# Altium schematic sheet PS.SchDoc
size A4
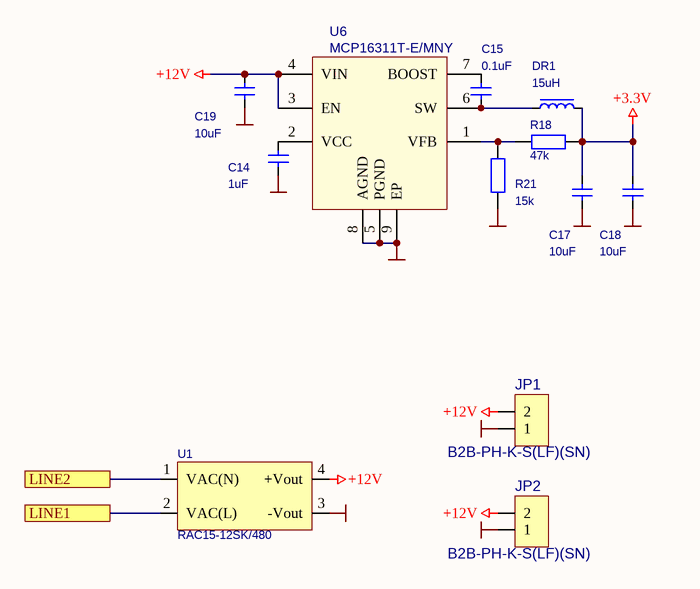
[diagram p0: PS.SchDoc]

## Parts
C14  1uF  [C-0805]
C15  0.1uF  [C-0603]
C17  10uF  [C-1206]
C18  10uF  [C-1206]
C19  10uF  [C-1206]
DR1  15uH  [NRS4018]
JP1  B2B-PH-K-S(LF)(SN)  [JST_B2B-PH-K-S]
JP2  B2B-PH-K-S(LF)(SN)  [JST_B2B-PH-K-S]
R18  47k  [R-0603]
R21  15k  [R-0603]
U1  RAC15-12SK/480  [RAC15]
U6  MCP16311T-E/MNY  [TDFN8]

## Ports
LINE1, LINE2

## Nets
+3.3V: C17.1 C18.1 DR1.2 R18.2
+12V: C19.1 JP1.2 JP2.2 U1.4(+Vout) U6.3(EN) U6.4(VIN)
GND: C14.1 C17.2 C18.2 C19.2 JP1.1 JP2.1 R21.2 U1.3(-Vout) U6.5(PGND) U6.8(AGND) U6.9(EP)
LINE1: U1.2(VAC(L)) ; port LINE1
LINE2: U1.1(VAC(N)) ; port LINE2
NetC14_2: C14.2 U6.2(VCC)
NetC15_1: C15.1 DR1.1 U6.6(SW)
NetC15_2: C15.2 U6.7(BOOST)
NetR18_1: R18.1 R21.1 U6.1(VFB)

## Library data of the parts
C14 C17-C19 = C: X7R 16V; Manufacturer: Generic; Supplier 1: Digi-Key
C15 = C: CAP CER; Manufacturer: Generic; Supplier 1: Digi-Key
DR1 = L*: FIXED IND 15UH 850MA 252MOHM SMD; Manufacturer Part Number: NRS4018T150MDGJ; Manufacturer: Taiyo Yuden; Supplier Part Number 1: 587-2887-1-ND; Supplier 1: Digi-Key
JP1 JP2 = CON2: CONN HEADER VERT 2POS 2MM; Manufacturer: JST Sales America Inc.; WEB: *; Supplier Part Number 1: 455-1704-ND; Supplier 1: Digi-Key; Manufacturer Part Number: B2B-PH-K-S(LF)(SN)
R18 R21 = R: Resistor; Manufacturer: Generic; Supplier 1: Digi-Key
U1 = RAC15: 15W AC/DC-CONVERTER; Manufacturer: Recom Power; Manufacturer Part Number: RAC15-12SK/480; Supplier 1: Digi-Key; Supplier Part Number 1: 945-RAC15-12SK/480-ND
U6 = MCP16311: IC REG BUCK ADJUSTABLE 1A 8TDFN; Manufacturer: Microchip Technology; Supplier 1: Digi-Key; Supplier Part Number 1: MCP16311T-E/MNYCT-ND; Manufacturer Part Number: MCP16311T-E/MNY